# Altium schematic sheet Power_and_Shield_Conn.SchDoc
size B; CompanyName: Rigado, LLC; Organization: Rigado, LLC; SheetNumber: 3; SheetTotal: X; SheetSize: B; SheetTitle: Power_and_Shield_Connectors
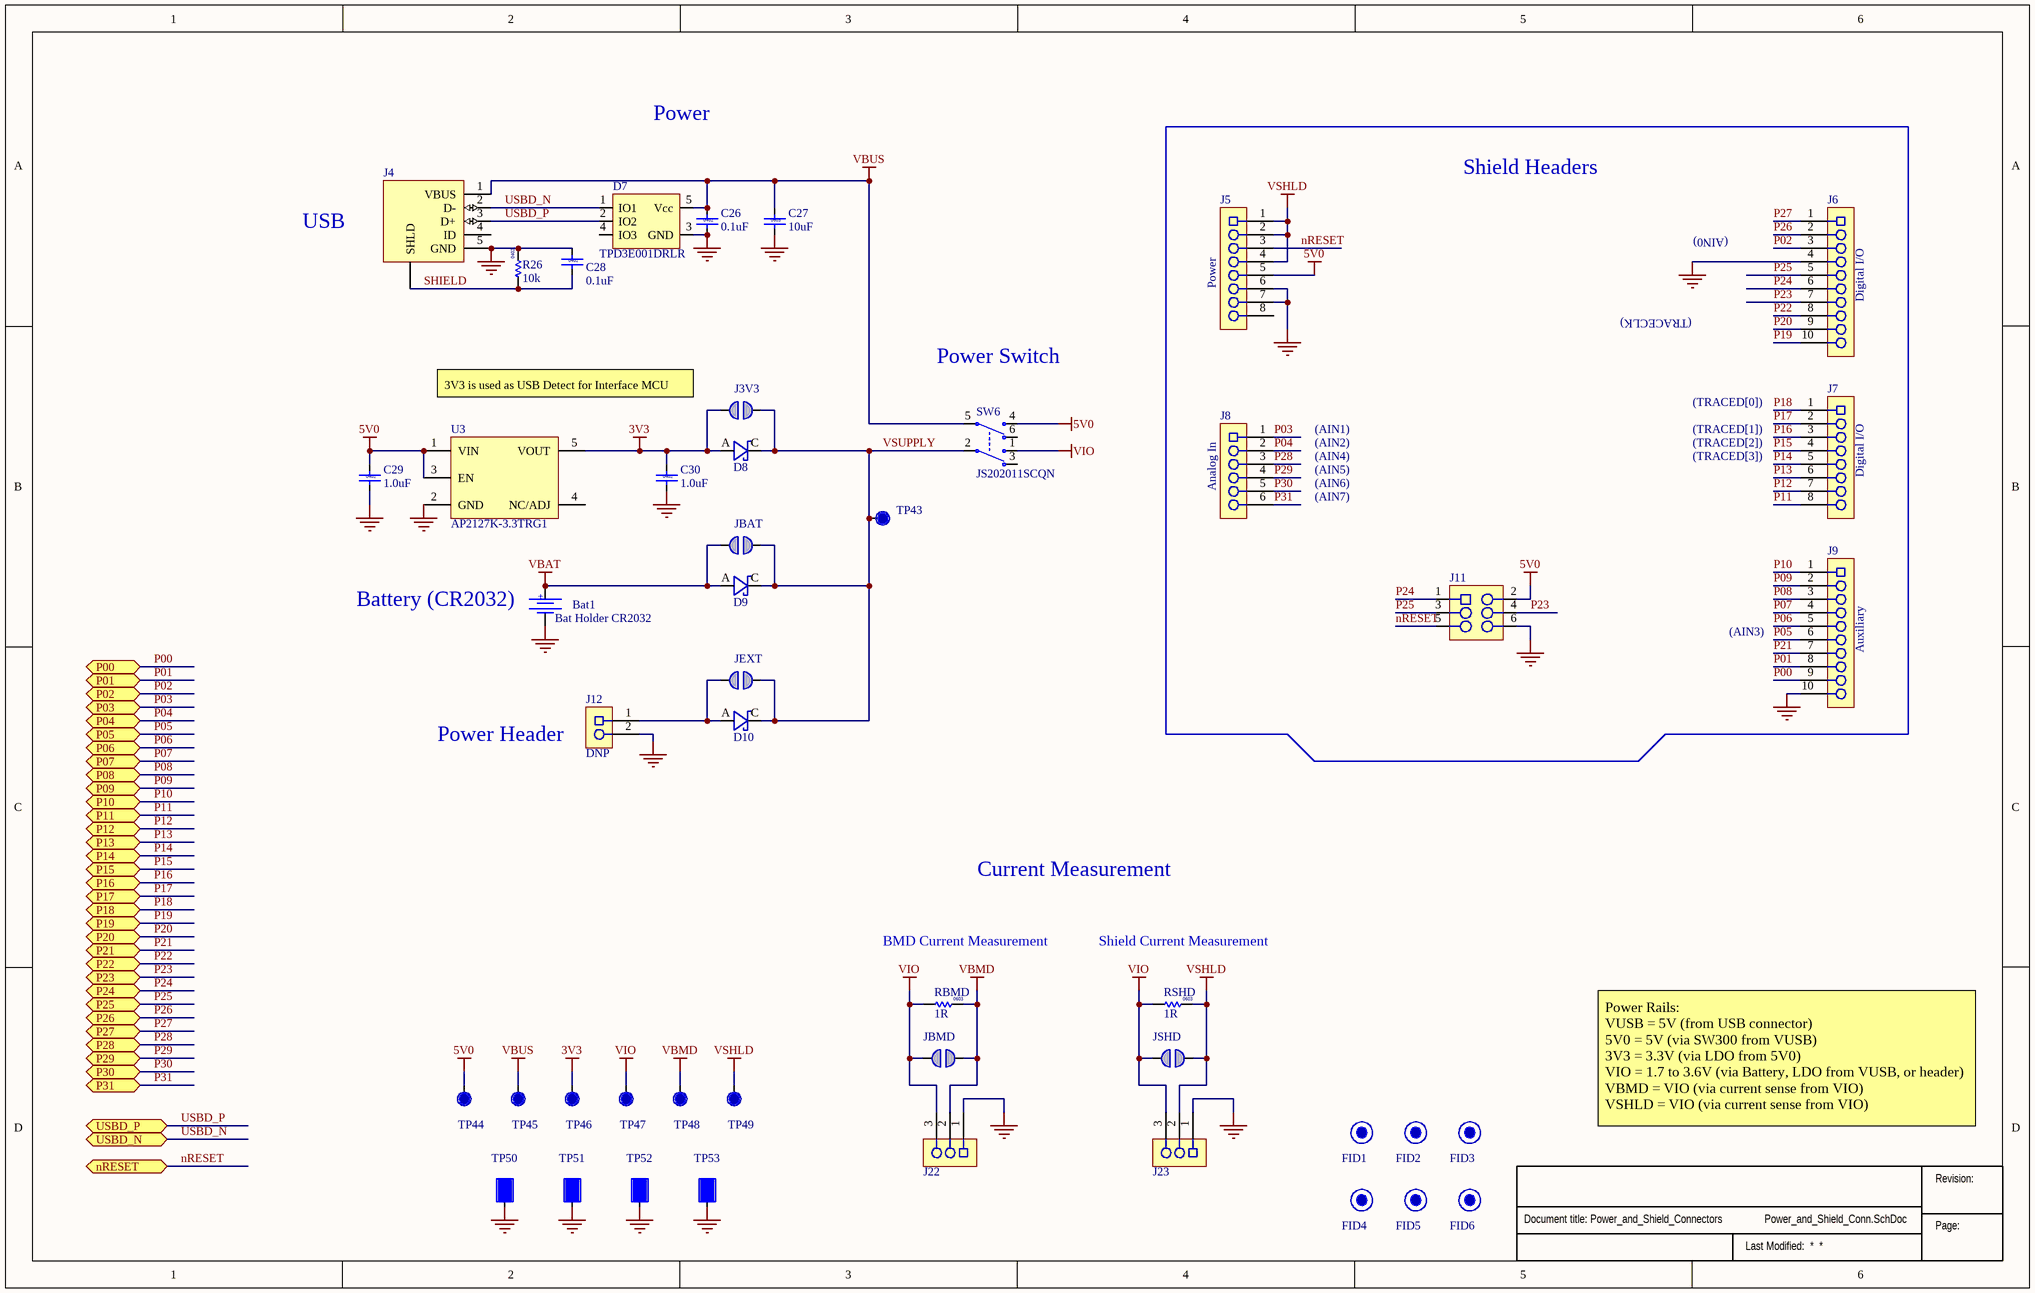
[diagram p0: Power_and_Shield_Conn.SchDoc]

## Parts
?  (no value)  (graphical)
Bat1  Bat Holder CR2032  [CR2032_HOLDER_SMD]
C26  value 0.1uF  Size: 0402  [Cap 0402 HD]  (hidden comment: 120-000160.1uF)
C27  value 10uF  Size: 0603  [Cap 0603 HD]  (hidden comment: 120-0002410uF)
C28  value 0.1uF  Size: 0402  [Cap 0402 HD]  (hidden comment: 120-000160.1uF)
C29  value 1.0uF  Size: 0402  [Cap 0402 HD]  (hidden comment: 120-000171.0uF)
C30  value 1.0uF  Size: 0402  [Cap 0402 HD]  (hidden comment: 120-000171.0uF)
D7  Manufacturer P/N: TPD3E001DRLR  [SOT-553]  (hidden comment: 110-00018)
D8  110-00008  [SOD-123]  (value not drawn)
D9  110-00008  [SOD-123]  (value not drawn)
D10  110-00008  [SOD-123]  (value not drawn)
FID1  FID  [FIDUCIAL40]  (value not drawn)
FID2  FID  [FIDUCIAL40]  (value not drawn)
FID3  FID  [FIDUCIAL40]  (value not drawn)
FID4  FID  [FIDUCIAL40]  (value not drawn)
FID5  FID  [FIDUCIAL40]  (value not drawn)
FID6  FID  [FIDUCIAL40]  (value not drawn)
J3V3  Solderbridge-OpenDNP  [Solderbridge-Open]  (value not drawn)  (no BOM)
J4  130-00008  [USB_Micro_RA_W-2TABS]  (value not drawn)
J5  130-00102  [SKT-0.1P-SSM-108-L-SV]  (value not drawn)
J6  130-00101  [SKT-0.1P-SSM-110-L-SV]  (value not drawn)
J7  130-00102  [SKT-0.1P-SSM-108-L-SV]  (value not drawn)
J8  130-00103  [SKT-0.1P-SSM-106-L-SV]  (value not drawn)
J9  130-00101  [SKT-0.1P-SSM-110-L-SV]  (value not drawn)
J11  130-00104  [HDR-0.1P-6Pin-3x2-SMT]  (value not drawn)
J12  130-00048DNP  [HDR-0.1P-2PIN-TH]  (value not drawn)
J22  130-00105  [HDR-0.1P-3Pin-1Row-SMT]  (value not drawn)
J23  130-00105  [HDR-0.1P-3Pin-1Row-SMT]  (value not drawn)
JBAT  Solderbridge-OpenDNP  [Solderbridge-Open]  (value not drawn)  (no BOM)
JBMD  Solderbridge-OpenDNP  [Solderbridge-Open]  (value not drawn)  (no BOM)
JEXT  Solderbridge-OpenDNP  [Solderbridge-Open]  (value not drawn)  (no BOM)
JSHD  Solderbridge-OpenDNP  [Solderbridge-Open]  (value not drawn)  (no BOM)
R26  value 10k  Size: 0402  [RES 0402 HD]  (hidden comment: 180-0002410k)
RBMD  value 1R  Size: 0603  [RES 0603 HD]  (hidden comment: 180-001091R)
RSHD  value 1R  Size: 0603  [RES 0603 HD]  (hidden comment: 180-001091R)
SW6  Manufacturer P/N: JS202011SCQN  [SW_Slide_DPDT_JS202011SCQN]  (hidden comment: 137-00006)
TP43  TP  [TP10R]  (value not drawn)
TP44  TP  [TP12R]  (value not drawn)
TP45  TP  [TP12R]  (value not drawn)
TP46  TP  [TP12R]  (value not drawn)
TP47  TP  [TP12R]  (value not drawn)
TP48  TP  [TP12R]  (value not drawn)
TP49  TP  [TP12R]  (value not drawn)
TP50  TP4.5x3SqDNP  [TP4.5x3Sq]  (value not drawn)
TP51  TP4.5x3SqDNP  [TP4.5x3Sq]  (value not drawn)
TP52  TP4.5x3SqDNP  [TP4.5x3Sq]  (value not drawn)
TP53  TP4.5x3SqDNP  [TP4.5x3Sq]  (value not drawn)
U3  Manufacturer P/N: AP2127K-3.3TRG1  [SOT-23-5]  (hidden comment: 260-00024)

## Blocks framed on the sheet
Shield Headers: J5-J9 J11

## Ports
nRESET (bidir), P00 (bidir), P01 (bidir), P02 (bidir), P03 (bidir), P04 (bidir), P05 (bidir), P06 (bidir), P07 (bidir), P08 (bidir), P09 (bidir), P10 (bidir), P11 (bidir), P12 (bidir), P13 (bidir), P14 (bidir), P15 (bidir), P16 (bidir), P17 (bidir), P18 (bidir), P19 (bidir), P20 (bidir), P21 (bidir), P22 (bidir), P23 (bidir), P24 (bidir), P25 (bidir), P26 (bidir), P27 (bidir), P28 (bidir), P29 (bidir), P30 (bidir), P31 (bidir), USBD_N (bidir), USBD_P (bidir)

## Nets
3V3: C30.1 D8.A(Anode) J3V3.2 TP46.1 U3.5(VOUT)
5V0: C29.1 J5.5 J11.2 SW6.4(N.O-2) TP44.1 U3.1(VIN) U3.3(EN)
GND: Bat1.2 C26.2 C27.2 C28.1 C29.2 C30.2 D7.3(GND) J4.5(GND) J5.6 J5.7 J6.4 J9.10 J11.6 J12.2 J22.1 J23.1 R26.2 TP50.1 TP51.1 TP52.1 TP53.1 U3.2(GND)
VBAT: Bat1.1 D9.A(Anode) JBAT.2
VBMD: J22.2 JBMD.1 RBMD.2 TP48.1
VBUS: C26.1 C27.1 D7.5(Vcc) J4.1(VBUS) SW6.5(COM-2) TP45.1
VIO: J22.3 J23.3 JBMD.2 JSHD.2 RBMD.1 RSHD.1 SW6.1(N.O-1) TP47.1
VSHLD: J5.1 J5.2 J5.4 J23.2 JSHD.1 RSHD.2 TP49.1
nRESET: J5.3 J11.5 ; port nRESET
P00: J9.9 ; port P00
P01: J9.8 ; port P01
P02: J6.3 ; port P02
P03: J8.1 ; port P03
P04: J8.2 ; port P04
P05: J9.6 ; port P05
P06: J9.5 ; port P06
P07: J9.4 ; port P07
P08: J9.3 ; port P08
P09: J9.2 ; port P09
P10: J9.1 ; port P10
P11: J7.8 ; port P11
P12: J7.7 ; port P12
P13: J7.6 ; port P13
P14: J7.5 ; port P14
P15: J7.4 ; port P15
P16: J7.3 ; port P16
P17: J7.2 ; port P17
P18: J7.1 ; port P18
P19: J6.10 ; port P19
P20: J6.9 ; port P20
P21: J9.7 ; port P21
P22: J6.8 ; port P22
P23: J6.7 J11.4 ; port P23
P24: J6.6 J11.1 ; port P24
P25: J6.5 J11.3 ; port P25
P26: J6.2 ; port P26
P27: J6.1 ; port P27
P28: J8.3 ; port P28
P29: J8.4 ; port P29
P30: J8.5 ; port P30
P31: J8.6 ; port P31
SHIELD: C28.2 J4.6(SHLD) R26.1
USBD_N: D7.1(IO1) J4.2(D-) ; port USBD_N
USBD_P: D7.2(IO2) J4.3(D+) ; port USBD_P
VSUPPLY: D8.C(Cathode) D9.C(Cathode) D10.C(Cathode) J3V3.1 JBAT.1 JEXT.1 SW6.2(COM-1) TP43.1
NetD10_A: D10.A(Anode) J12.1 JEXT.2

Not connected (* = marked no-connect by the designer): D7 4(IO3); J4 4(ID); J5 8; SW6 3(N.C-1) 6(N.C-2); U3 4(NC/ADJ)

## Notes on the sheet
- Power
- USB
- (AIN0)
- (near J5) Power
- (near J6) Digital I/O
- Power Switch
- (TRACECLK)
- 3V3 is used as USB Detect for Interface MCU
- (AIN1)
- (TRACED[0])
- (TRACED[1])
- (near J8) Analog In
- (AIN2)
- (AIN4)
- (AIN5)
- (AIN6)
- (AIN7)
- (TRACED[2])
- (TRACED[3])
- (near J7) Digital I/O
- (near Bat1) Battery (CR2032)
- (AIN3)
- (near J9) Auxiliary
- (near J12) Power Header
- Current Measurement
- BMD Current Measurement
- Shield Current Measurement
- Power Rails:
  VUSB = 5V (from USB connector)
  5V0 = 5V (via SW300 from VUSB)
  3V3 = 3.3V (via LDO from 5V0)
  VIO = 1.7 to 3.6V (via Battery, LDO from VUSB, or header)
  VBMD = VIO (via current sense from VIO)
  VSHLD = VIO (via current sense from VIO)
- Revision:
- Page:
- (in symbol Battery) +

## Library data of the parts
? = Sub_Title_Block: Minimized schematic title block for all subset sheets
Bat1 = Battery: Bat Holder CR2032 SMD; Manufacturer: Keystone; Manufacturer Part Number: 3002; 2nd source part number: 69-525-27; Artikkelnr Noca: 34019038; Artikkelnr Simpro: N.A.; Part Number: Bat Holder CR2032 SMD; Datasheet: http://www.farnell.com/datasheets/45480.pdf; LatestRevisionDate: 2011-05-11; Pin Count: 3; Publisher: Nordic Semiconductor; Published: 2009-12-12; Value: Bat Holder CR2032; Note: Bat Holder CR2032; Supplier: Farnell; Supplier part number: 165-0693; 2nd source Supplier: Elfa; Footprint Doc: CR2032_HOLDER_SMD
C26 C28 = 120-00016: Cap, Ceramic 0.1uF 10V 10% X5R 0402; Part Name: CAP CER 0.1UF 10V 10% X5R 0402; Part_Type: Ceramic Capacitor; Manufacturer: Murata Electronics North America; Manufacturer P/N: GRM155R61A104KA01J; Item_Phase: Production; Component Mounting Type: SMT; Tolerance: +/- 10%; Use in new designs: Yes; Part Number: 120-00016; Revision: 0A; Supplier 1: Digi-Key; Supplier Part Number 1: 490-6297-1-ND; Manufacturer 2: Yageo; Manufacturer P/N 2: CC0402KRX5R6BB104; Supplier 2: Digi-Key; Supplier Part Number 2: 311-1336-1-ND; Arena Link: https://app.bom.com/a/GYHPV2L2L43KRMBK?v=spec.summary; Height: 0.55mm; Pins: 2; Temperature Coefficient: X5R; Voltage: 10V
C27 = 120-00024: Cap, Ceramic 10uF 10V 20% X5R 0603; Part Name: CAP CER 10UF 10V 20% X5R 0603; Part_Type: Ceramic Capacitor; Manufacturer: Murata Electronics North America; Manufacturer P/N: GRM188R61A106ME69D; Item_Phase: Preliminary; Component Mounting Type: SMT; Tolerance: +/- 20%; Use in new designs: Yes; Part Number: 120-00024; Supplier 1: Digi-Key; Supplier Part Number 1: 490-10475-1-ND; Arena Link: https://app.bom.com/a/L3MU07Q7Q98PUPRN?v=spec.summary; Height: 0.9mm; Pins: 2; Temperature Coefficient: X5R; Voltage: 10V
C29 C30 = 120-00017: Cap, Ceramic, 1.0uF 10V 10% X5R, 0402; Part Name: CAP CER 1UF 10V 10% X5R 0402; Part_Type: Ceramic Capacitor; Manufacturer: Murata Electronics North America; Manufacturer P/N: GRM155R61A105KE15D; Item_Phase: Production; Component Mounting Type: SMT; Tolerance: +/- 10%; Use in new designs: Yes; Part Number: 120-00017; Revision: 0A; Supplier 1: Digi-Key; Supplier Part Number 1: 490-3890-1-ND; Manufacturer 2: TDK Corporation; Manufacturer P/N 2: C1005X5R1A105K050BB; Supplier 2: Digi-Key; Supplier Part Number 2: 445-4114-1-ND; Arena Link: https://app.bom.com/a/1J2AGN6N6PO5C7V9?v=spec.summary; Height: 0.55mm; Pins: 2; Temperature Coefficient: X5R; Voltage: 10V
D7 = 110-00018: LOW-CAPACITANCE 3-CHANNEL ESD-PROTECTION ARRAY; Part Name: TVS Diode, 3CH High Speed ESD; Part_Type: Diode; Manufacturer: Texas Instruments; Item_Phase: Production; Body Size: 1.6mm x 1.2mm; Component Mounting Type: SMT; Diode Type: TVS; Use in new designs: Yes; Voltage: 5V; Part Number: 110-00018; Revision: 0A; Supplier 1: Digi-Key; Supplier Part Number 1: 296-21885-1-ND; Arena Link: https://app.bom.com/a/UCV39GZGZIHX50AE?v=spec.summary; Height: .55mm; MFG Package: SOT-553; Package Type: SOT; Pins: 5
D8-D10 = 110-00008: Part Name: Diode Schottky 20V 500mA SOD-123; Part_Type: Diode; Manufacturer: Fairchild Semiconductor; Manufacturer P/N: MBR0520L; Item_Phase: Production; Body Size: 2.85mm x 1.80mm; Component Mounting Type: SMT; Current: 500mA; Diode Type: Schottky; Use in new designs: Yes; Voltage: 20V; Part Number: 110-00008; Revision: 0A; Supplier 1: Digi-Key; Supplier Part Number 1: MBR0520LCT-ND; Arena Link: https://app.bom.com/a/UCV39GZGZIHXE7KX?v=spec.summary; Height: 1.28mm; MFG Package: SOD-123; Package Type: SOD; Pins: 2
FID1-FID6 = FIDUCIAL.04: Fiducial, 0.040" inner Dia, 0.075" outer Dia; Added By: Jeremy D; Part Number: FIDUCIAL.04; Size: 0.040"; Height: 0; DNP: DNP; Added Date: 2/1/2015; Checked By: Paul B; Checked Date: 2/5/2015
J3V3 JBAT JBMD JEXT JSHD = Solderbridge-Open: Added By: Paul B; Part Number: Solderbridge-Open; Height: 0; DNP: DNP; Added Date: 12/2/2015
J4 = 130-00008: USB Micro B Receptacle, Right Angle, SMT with 2 TH Tabs; Part Name: CON USB Micro-B 0.65mm 6Pin 1Row SMT RA; Part_Type: Connector; Manufacturer: FCI; Manufacturer P/N: 10118193-0001LF; Item_Phase: Preliminary; Keyed: Yes; Locking: No; Pin Pitch: 0.65mm; Rows: 1; Part Number: 130-00008; Supplier 1: Digi-Key; Supplier Part Number 1: 609-4616-1-ND; Arena Link: https://app.bom.com/a/O6PX3ATATCBTBM9U?v=spec.summary; Color: Silver; Component Mounting Type: SMT; Connector Type: USB; Height: 2.8mm; Length: 8mm; Pins: 6; Use in new designs: Yes; Width: 5mm
J5 J7 = 130-00102: Con Socket Strip 0.1" 8 Pin 1Row SMD; Part_Type: Connector; Manufacturer: Samtec; Manufacturer P/N: SSM-108-F-SV-P-TR; Item_Phase: Preliminary; Component Mounting Type: SMT; Keyed: No; Pin Pitch: 0.100"; Rows: 1; Use in new designs: Yes; Voltage: 572VDC; Part Number: 130-00102; Part Name: Con Socket Strip 0.1" 8 Pin 1Row SMD; Supplier 1: Avnet; Supplier Part Number 1: SSM-108-F-SV-P-TR; Arena Link: https://app.bom.com/a/M4NV18R8RA9O8APG?v=spec.summary; Color: Black; Connector Type: Socket; Height: 7.37mm; Length: 20.32mm; Locking: No; Pins: 8; Width: 2.54mm
J6 J9 = 130-00101: Con Socket Strip 0.1" 10Pin 1Row SMD; Part_Type: Connector; Manufacturer: Samtec; Manufacturer P/N: SSM-110-F-SV-P-TR; Item_Phase: Preliminary; Component Mounting Type: SMT; Keyed: No; Pin Pitch: 0.100"; Rows: 1; Use in new designs: Yes; Voltage: 572VDC; Part Number: 130-00101; Part Name: Con Socket Strip 0.1" 10Pin 1Row SMD; Supplier 1: Avnet; Supplier Part Number 1: SSM-110-F-SV-P-TR; Arena Link: https://app.bom.com/a/P7QY4BUBUDCRBDUU?v=spec.summary; Color: Black; Connector Type: Socket; Height: 7.37mm; Length: 25.4mm; Locking: No; Pins: 10; Width: 2.54mm
J8 = 130-00103: Con Socket Strip 0.1" 6Pin 1Row SMD; Manufacturer P/N: SSM-106-F-SV-P-TR; Part_Type: Connector; Manufacturer: Samtec; Item_Phase: Preliminary; Component Mounting Type: SMT; Keyed: No; Pin Pitch: 0.100"; Rows: 1; Use in new designs: Yes; Voltage: 572VDC; Part Number: 130-00103; Part Name: Con Socket Strip 0.1" 6Pin 1Row SMD; Supplier 1: Avnet; Supplier Part Number 1: SSM-106-F-SV-P-TR; Arena Link: https://app.bom.com/a/EWFNT0J0J21G02BU?v=spec.summary; Color: Black; Connector Type: Socket; Height: 7.37mm; Length: 15.24mm; Locking: No; Pins: 6; Width: 2.54mm
J11 = 130-00104: Header 0.1" 6 Pin 2 Row SMD Black; Part Name: CON Header 0.1" 6Pin 2Row SMD Black; Part_Type: Connector; Manufacturer: Molex Inc; Manufacturer P/N: 0015912060; Item_Phase: Preliminary; Component Mounting Type: SMT; Keyed: No; Pin Pitch: 0.100"; Rows: 2; Use in new designs: Yes; Part Number: 130-00104; Supplier 1: Digi-Key; Supplier Part Number 1: WM17449-ND; Arena Link: https://app.bom.com/a/FXGOU1K1K32H132M?v=spec.summary; Color: Black; Connector Type: Header; Height: 9.66mm; Length: 7.62mm; Locking: No; Pins: 6; Width: 5.08mm
J12 = 130-00048: Header 0.100" Pitch, 2 Pin, 2x1, TH.; Manufacturer P/N: PRPC001DAAN-RC; Part Name: CONN HEADER .100" DUAL STR 2POS; Part_Type: Connector; Manufacturer: Sullins Connector Solutions; Item_Phase: Production; Component Mounting Type: Through Hole; Keyed: No; Rows: 1; Use in new designs: Yes; DNP: DNP; Part Number: 130-00048; Revision: 0A; Supplier 1: Digi-Key; Supplier Part Number 1: S2011EC-01-ND; Arena Link: https://app.bom.com/a/0I19FM5M5ON3K84A?v=spec.summary; Color: Black; Connector Type: Header; Height: 0.32"; Locking: No; Pin Pitch: 0.100"; Pins: 2
J22 J23 = 130-00105: Header, 0.100" Pitch, 3 Pin, Vertical SMT; Manufacturer P/N: M20-8770342; Part Name: CON HDR 0.1" 3 Pin SMT; Part_Type: Connector; Manufacturer: Harwin Inc; Item_Phase: Preliminary; Keyed: No; Rows: 1; Use in new designs: Yes; Part Number: 130-00105; Supplier 1: Digi-Key; Supplier Part Number 1: 952-1951-ND; Arena Link: https://app.bom.com/a/BTCKQXGXGZYCIWHE?v=spec.summary; Color: Black; Component Mounting Type: SMT; Connector Type: Header; Height: 9.93mm; Length: 7.62mm; Locking: No; Pin Pitch: 0.100"; Pins: 3; Width: 5.08mm
R26 = 180-00024: Resistor 10k ohm 1% 1/16W, 0402; Part Name: RES SMD 10K OHM 1% 1/16W 0402; Manufacturer: Rohm Semiconductor; Manufacturer P/N: MCR01MRTF1002; Item_Phase: Production; Component Mounting Type: SMT; Tolerance: +/- 1%; Use in new designs: Yes; Part Number: 180-00024; Part_Type: Resistor; Revision: 0A; Supplier 1: Digi-Key; Supplier Part Number 1: RHM10.0KCDCT-ND; Manufacturer 2: Samsung Electro-Mechanics America, Inc; Manufacturer P/N 2: RC1005F103CS; Arena Link: https://app.bom.com/a/0I19FM5M5ON4B4RQ?v=spec.summary; Height: 0.4mm; Pins: 2; Power: 1/16W; Voltage: N/A
RBMD RSHD = 180-00109: Resistor 1 ohm 1%, 1/10W, 0603; Part Name: RES SMD 1 OHM 1% 1/10W 0603; Manufacturer: Samsung Electro-Mechanics America, Inc; Manufacturer P/N: RC1608F1R0CS; Item_Phase: Preliminary; Component Mounting Type: SMT; Tolerance: +/- 1%; Use in new designs: Yes; Part Number: 180-00109; Part_Type: Resistor; Supplier 1: Digi-Key; Supplier Part Number 1: 1276-4471-1-ND; Manufacturer 2: Yageo; Manufacturer P/N 2: RC0603FR-071RP; Supplier 2: Digi-Key; Supplier Part Number 2: YAG1295CT-ND; Arena Link: https://app.bom.com/a/Q8RZ5CVCVEDTXJ3Q?v=spec.summary; Height: 0.55mm; Pins: 2; Power: 1/10W
SW6 = 137-00006: SWITCH SLIDE DPDT 300MA 6V SMD; Manufacturer: C&K Components; Item_Phase: Preliminary; Component Mounting Type: SMT; Switch/Button Function: On-On; Use in new designs: Yes; Part Number: 137-00006; Part Name: SWITCH SLIDE DPDT 300MA 6V SMD; Part_Type: Switch; Supplier 1: Digi-Key; Supplier Part Number 1: 401-2002-1-ND; Arena Link: https://app.bom.com/a/5N6EKRARATS6M48O?v=spec.summary; Color: Silver; Current: 300mA; Height: 5.5mm; Length: 9mm; Pins: 6; Switch/Button Circuit: DPDT; Voltage: 6V; Width: 3.6mm
TP43 = TP10R: Testpoint, Round 1.0mm Dia; Added By: Jeremy D; Part Number: TP10R; Size: 1.0mm; Height: 0; DNP: DNP; Added Date: 2/1/2015; Checked By: Paul B; Checked Date: 2/5/2015
TP44-TP49 = TP12R: Testpoint, Round 1.2mm Dia; Added By: Cam N; Part Number: TP12R; Size: 1.2mm; Height: 0; DNP: DNP; Added Date: 2/5/2016
TP50-TP53 = TP4.5x3Sq: Testpoint, Rectangular 4.5mm x 3mm; Added By: Jeremy D; Part Number: TP4.5x3Sq; Size: 4.5mm x 3mm; Height: 0; DNP: DNP; Added Date: 8/21/2015
U3 = 260-00024: IC REG LDO 3.3V 0.3A SOT23-5; Part_Type: Power Supply; Manufacturer: Diodes Incorporated; Item_Phase: Preliminary; Body Size: 1.7mm x 3.1mm; Component Mounting Type: SMT; Current: 300mA; Regulator Outputs: 1xLDO; SMT Pitch: 0.95mm; Use in new designs: Yes; Voltage: 6V; Part Number: 260-00024; Part Name: IC REG LDO 3.3V 0.3A SOT23-5; Supplier 1: Digi-Key; Supplier Part Number 1: AP2127K-3.3TRG1DICT-ND; Arena Link: https://app.bom.com/a/5N6EKRARATS6ONGB?v=spec.summary; Height: 1.45mm; MFG Package: SOT-23-5; Package Type: SOT; Pins: 5